# Altium project UltraZohm Analog SlowADC Signal Adapter 1v01 3U.PrjPcb (part 1 of 2)
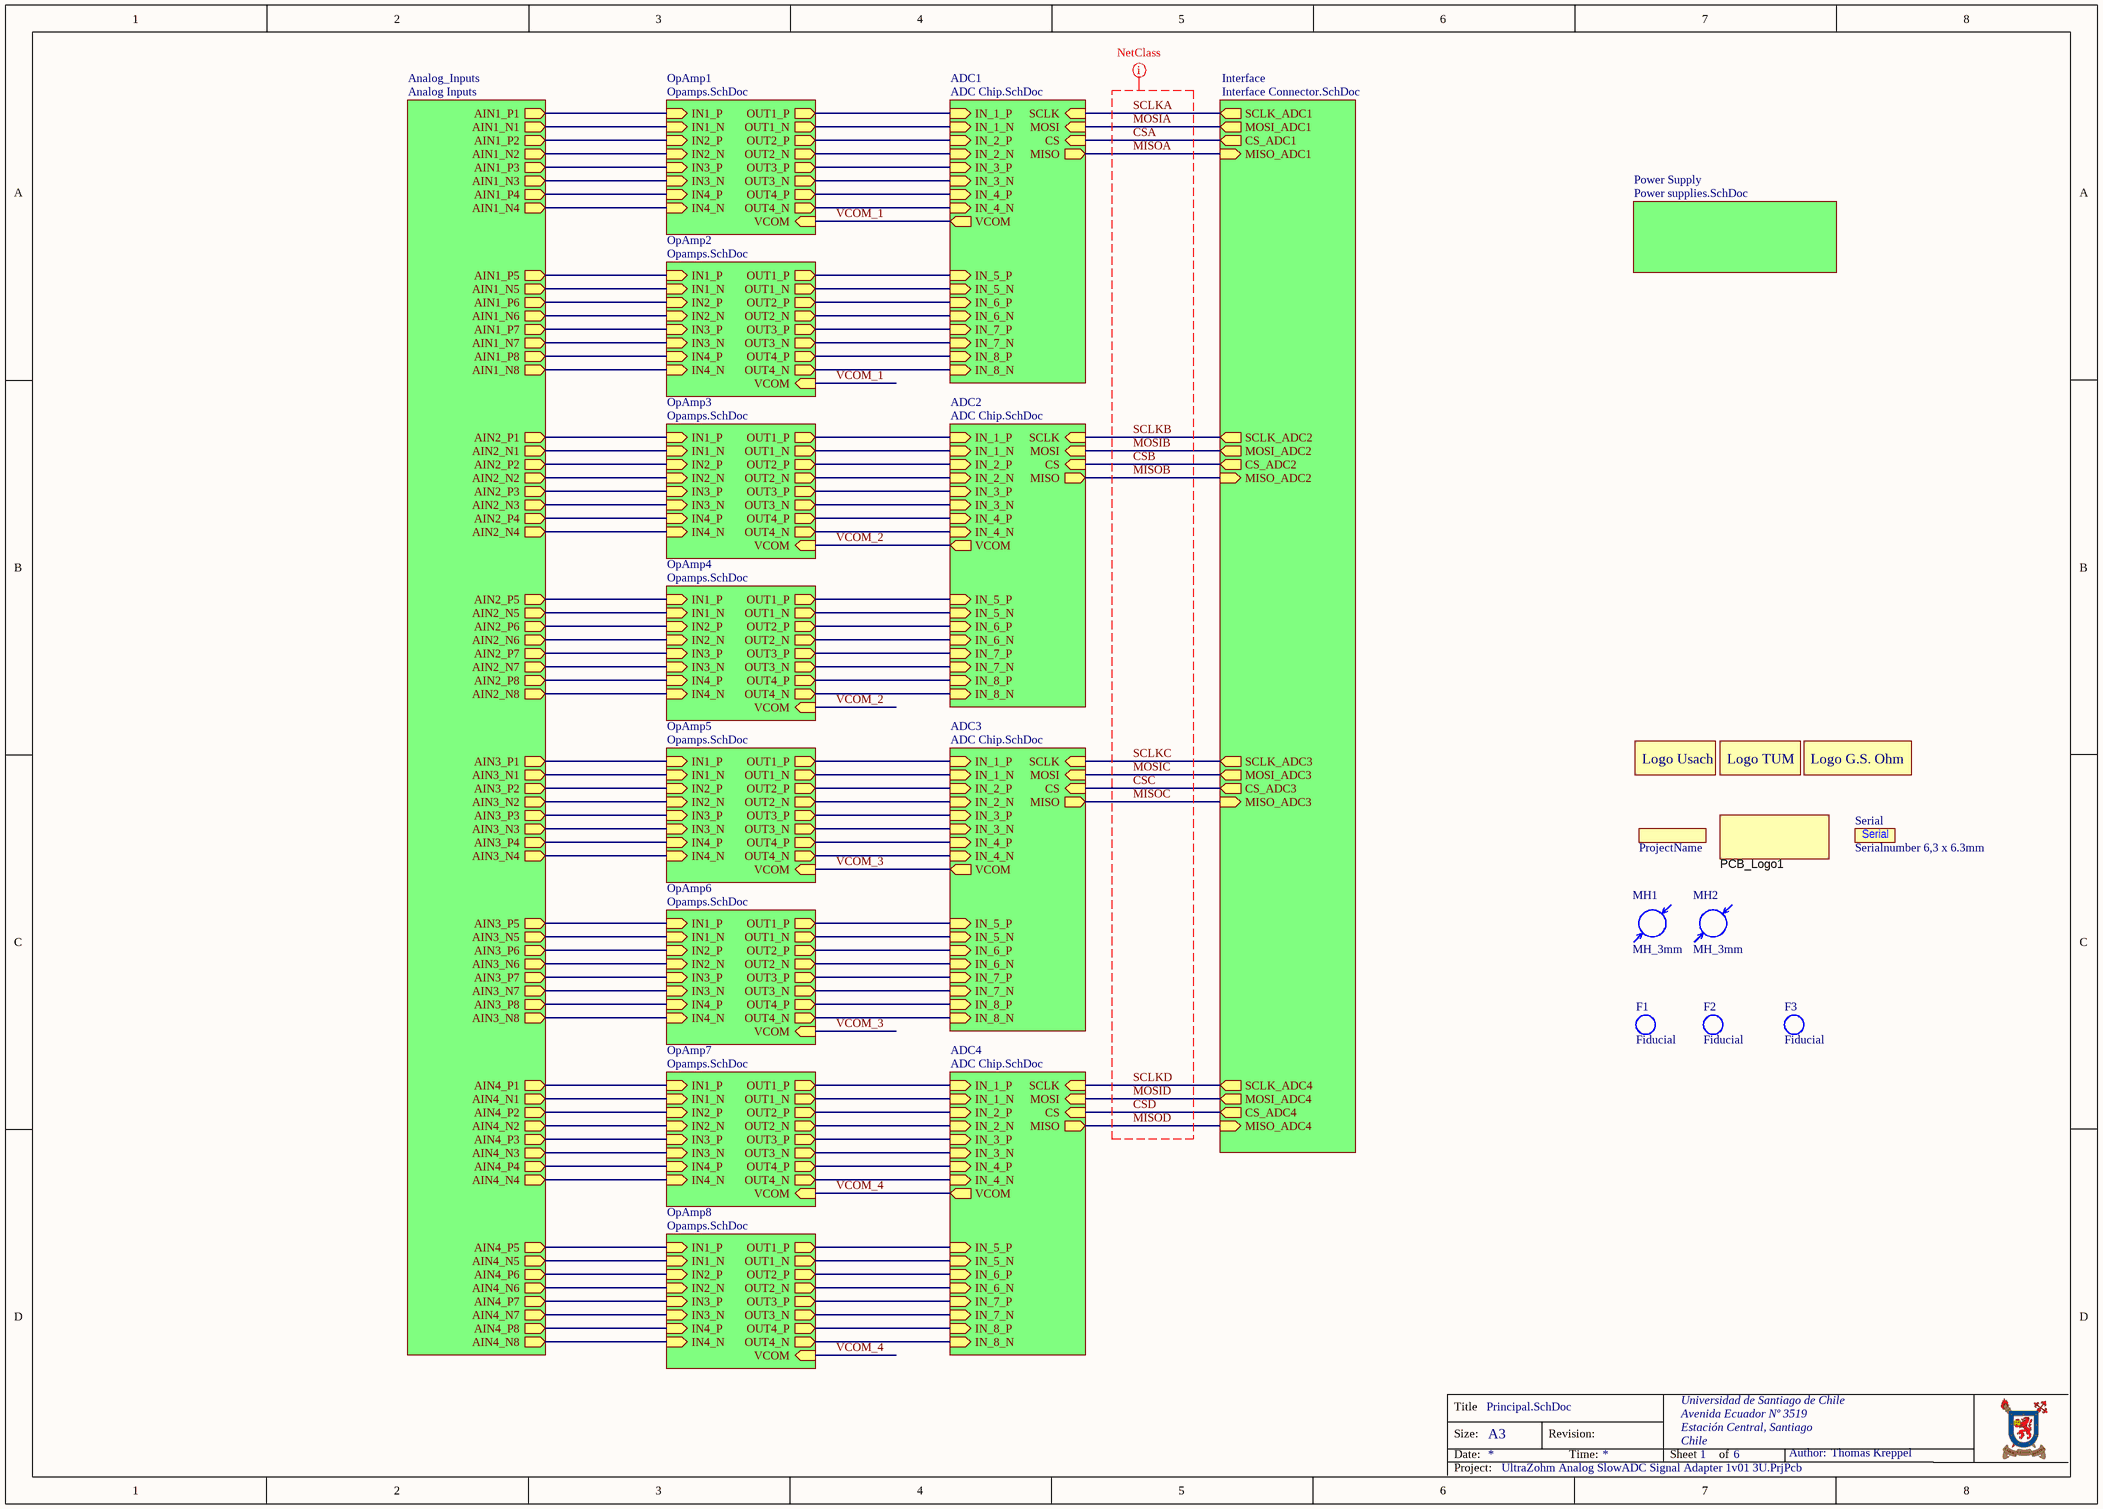
[diagram p0: Principal.SchDoc]
ProjectRevision: 1v01
5 sheets, 498 parts. Net scope: hierarchical (ports join the sheet entries above them; power ports are global).
Board file: UltraZohm_Analog_Slow_ADC Signal Adapter 1v01 3U.PcbDoc
Sheets:
  Principal.SchDoc
    Interface = Interface Connector.SchDoc
    Analog_Inputs = Analog Inputs.SchDoc
    Power Supply = Power supplies.SchDoc
    OpAmp1 = Opamps.SchDoc
    OpAmp2 = Opamps.SchDoc
    OpAmp3 = Opamps.SchDoc
    OpAmp4 = Opamps.SchDoc
    OpAmp5 = Opamps.SchDoc
    OpAmp6 = Opamps.SchDoc
    OpAmp7 = Opamps.SchDoc
    OpAmp8 = Opamps.SchDoc

## Sheet Principal.SchDoc
size A3; Author: Thomas Kreppel; CompanyName: Universidad de Santiago de Chile; Address1: Avenida Ecuador Nº 3519; Address2: Estación Central, Santiago; Address3: Chile; DocumentNumber: 1; Revision: 1v01; SheetNumber: 1; SheetTotal: 6

### Parts
F1  Fiducial  [Fiducial_1.7mm]  (no BOM)
F2  Fiducial  [Fiducial_1.7mm]  (no BOM)
F3  Fiducial  [Fiducial_1.7mm]  (no BOM)
Logo1  LOGO USACH  [Logo Usach]  (value not drawn)  (no BOM)
Logo2  LOGO TUM  [Logo TUM]  (value not drawn)  (no BOM)
Logo3  LOGO G.S. Ohm  [Logo G.S.Ohm University]  (value not drawn)  (no BOM)
MH1  MH_3mm  [Mounting Hole]  (no BOM)
MH2  MH_3mm  [Mounting Hole]  (no BOM)
PCB_Logo1  ESD Susceptible  [ESD_Overlay_Medium]  (value not drawn)  (no BOM)
ProjectName  Project Name, Rev  [ID_ProjectRev]  (value not drawn)  (no BOM)
Serial  Serialnumber 6,3 x 6.3mm  [Serial_6.3x6.3mm]  (no BOM)

### Sub-sheets
ADC1 = ADC Chip.SchDoc (file not in this document): IN_1_P (in), IN_7_N (in), IN_5_P (in), IN_4_P (in), IN_1_N (in), MOSI (in), IN_6_P (in), IN_2_P (in), IN_2_N (in), IN_5_N (in), CS (in), IN_6_N (in), IN_3_N (in), IN_8_N (in), IN_7_P (in), IN_4_N (in), MISO (out), IN_8_P (in), SCLK (in), IN_3_P (in), VCOM (out)
ADC2 = ADC Chip.SchDoc (file not in this document): IN_1_P (in), IN_7_N (in), IN_5_P (in), IN_4_P (in), IN_1_N (in), MOSI (in), IN_6_P (in), IN_2_P (in), IN_2_N (in), IN_5_N (in), CS (in), IN_6_N (in), IN_3_N (in), IN_8_N (in), IN_7_P (in), IN_4_N (in), MISO (out), IN_8_P (in), SCLK (in), IN_3_P (in), VCOM (out)
ADC3 = ADC Chip.SchDoc (file not in this document): IN_1_P (in), IN_7_N (in), IN_5_P (in), IN_4_P (in), IN_1_N (in), MOSI (in), IN_6_P (in), IN_2_P (in), IN_2_N (in), IN_5_N (in), CS (in), IN_6_N (in), IN_3_N (in), IN_8_N (in), IN_7_P (in), IN_4_N (in), MISO (out), IN_8_P (in), SCLK (in), IN_3_P (in), VCOM (out)
ADC4 = ADC Chip.SchDoc (file not in this document): IN_1_P (in), IN_7_N (in), IN_5_P (in), IN_4_P (in), IN_1_N (in), MOSI (in), IN_6_P (in), IN_2_P (in), IN_2_N (in), IN_5_N (in), CS (in), IN_6_N (in), IN_3_N (in), IN_8_N (in), IN_7_P (in), IN_4_N (in), MISO (out), IN_8_P (in), SCLK (in), IN_3_P (in), VCOM (out)
Analog_Inputs = Analog Inputs: AIN1_N1 (out), AIN1_P1 (out), AIN1_N8 (out), AIN1_N7 (out), AIN2_N1 (out), AIN2_P1 (out), AIN2_P6 (out), AIN1_P2 (out), AIN1_P3 (out), AIN2_P2 (out), AIN2_P4 (out), AIN2_P8 (out), AIN1_P7 (out), AIN1_P5 (out), AIN1_N3 (out), AIN1_N2 (out), AIN1_N5 (out), AIN2_P5 (out), AIN1_P6 (out), AIN1_N4 (out), AIN1_P8 (out), AIN2_P3 (out), AIN2_P7 (out), AIN1_P4 (out), AIN1_N6 (out), AIN4_P8 (out), AIN3_P2 (out), AIN3_P7 (out), AIN2_N7 (out), AIN4_N3 (out), AIN2_N3 (out), AIN3_P1 (out), AIN4_P5 (out), AIN3_P5 (out), AIN3_N7 (out), AIN4_N2 (out), AIN4_N1 (out), AIN3_P4 (out), AIN4_P7 (out), AIN4_P3 (out), AIN3_P6 (out), AIN3_N1 (out), AIN4_N7 (out), AIN3_P8 (out), AIN4_N8 (out), AIN3_N3 (out), AIN2_N5 (out), AIN2_N4 (out), AIN4_P4 (out), AIN3_N2 (out), AIN4_N5 (out), AIN2_N8 (out), AIN3_N6 (out), AIN4_P1 (out), AIN4_N4 (out), AIN3_N4 (out), AIN2_N6 (out), AIN4_P2 (out), AIN4_P6 (out), AIN3_N8 (out), AIN4_N6 (out), AIN2_N2 (out), AIN3_N5 (out), AIN3_P3 (out)
Interface = Interface Connector.SchDoc: CS_ADC2 (out), CS_ADC4 (out), SCLK_ADC2 (out), SCLK_ADC4 (out), CS_ADC1 (out), MISO_ADC1 (in), MOSI_ADC4 (out), CS_ADC3 (out), SCLK_ADC3 (out), MOSI_ADC2 (out), MOSI_ADC3 (out), MISO_ADC4 (in), MISO_ADC3 (in), MISO_ADC2 (in), SCLK_ADC1 (out), MOSI_ADC1 (out)
OpAmp1 = Opamps.SchDoc: IN2_P (in), IN1_N (in), OUT3_P (out), IN4_P (in), IN3_N (in), OUT3_N (out), IN4_N (in), OUT4_N (out), OUT4_P (out), IN2_N (in), OUT1_N (out), OUT2_N (out), OUT1_P (out), VCOM (in), IN3_P (in), OUT2_P (out), IN1_P (in)
OpAmp2 = Opamps.SchDoc: IN2_P (in), IN1_N (in), OUT3_P (out), IN4_P (in), IN3_N (in), OUT3_N (out), IN4_N (in), OUT4_N (out), OUT4_P (out), IN2_N (in), OUT1_N (out), OUT2_N (out), OUT1_P (out), VCOM (in), IN3_P (in), OUT2_P (out), IN1_P (in)
OpAmp3 = Opamps.SchDoc: IN2_P (in), IN1_N (in), OUT3_P (out), IN4_P (in), IN3_N (in), OUT3_N (out), IN4_N (in), OUT4_N (out), OUT4_P (out), IN2_N (in), OUT1_N (out), OUT2_N (out), OUT1_P (out), VCOM (in), IN3_P (in), OUT2_P (out), IN1_P (in)
OpAmp4 = Opamps.SchDoc: IN2_P (in), IN1_N (in), OUT3_P (out), IN4_P (in), IN3_N (in), OUT3_N (out), IN4_N (in), OUT4_N (out), OUT4_P (out), IN2_N (in), OUT1_N (out), OUT2_N (out), OUT1_P (out), VCOM (in), IN3_P (in), OUT2_P (out), IN1_P (in)
OpAmp5 = Opamps.SchDoc: IN2_P (in), IN1_N (in), OUT3_P (out), IN4_P (in), IN3_N (in), OUT3_N (out), IN4_N (in), OUT4_N (out), OUT4_P (out), IN2_N (in), OUT1_N (out), OUT2_N (out), OUT1_P (out), VCOM (in), IN3_P (in), OUT2_P (out), IN1_P (in)
OpAmp6 = Opamps.SchDoc: IN2_P (in), IN1_N (in), OUT3_P (out), IN4_P (in), IN3_N (in), OUT3_N (out), IN4_N (in), OUT4_N (out), OUT4_P (out), IN2_N (in), OUT1_N (out), OUT2_N (out), OUT1_P (out), VCOM (in), IN3_P (in), OUT2_P (out), IN1_P (in)
OpAmp7 = Opamps.SchDoc: IN2_P (in), IN1_N (in), OUT3_P (out), IN4_P (in), IN3_N (in), OUT3_N (out), IN4_N (in), OUT4_N (out), OUT4_P (out), IN2_N (in), OUT1_N (out), OUT2_N (out), OUT1_P (out), VCOM (in), IN3_P (in), OUT2_P (out), IN1_P (in)
OpAmp8 = Opamps.SchDoc: IN2_P (in), IN1_N (in), OUT3_P (out), IN4_P (in), IN3_N (in), OUT3_N (out), IN4_N (in), OUT4_N (out), OUT4_P (out), IN2_N (in), OUT1_N (out), OUT2_N (out), OUT1_P (out), VCOM (in), IN3_P (in), OUT2_P (out), IN1_P (in)
Power Supply = Power supplies.SchDoc: no entries

### Nets
ADC_IN1_N_OpAmp1: sheet ADC1/IN_1_N, sheet OpAmp1/OUT1_N
ADC_IN1_N_OpAmp2: sheet ADC1/IN_5_N, sheet OpAmp2/OUT1_N
ADC_IN1_N_OpAmp3: sheet ADC2/IN_1_N, sheet OpAmp3/OUT1_N
ADC_IN1_N_OpAmp4: sheet ADC2/IN_5_N, sheet OpAmp4/OUT1_N
ADC_IN1_N_OpAmp5: sheet ADC3/IN_1_N, sheet OpAmp5/OUT1_N
ADC_IN1_N_OpAmp6: sheet ADC3/IN_5_N, sheet OpAmp6/OUT1_N
ADC_IN1_N_OpAmp7: sheet ADC4/IN_1_N, sheet OpAmp7/OUT1_N
ADC_IN1_N_OpAmp8: sheet ADC4/IN_5_N, sheet OpAmp8/OUT1_N
ADC_IN1_P_OpAmp1: sheet ADC1/IN_1_P, sheet OpAmp1/OUT1_P
ADC_IN1_P_OpAmp2: sheet ADC1/IN_5_P, sheet OpAmp2/OUT1_P
ADC_IN1_P_OpAmp3: sheet ADC2/IN_1_P, sheet OpAmp3/OUT1_P
ADC_IN1_P_OpAmp4: sheet ADC2/IN_5_P, sheet OpAmp4/OUT1_P
ADC_IN1_P_OpAmp5: sheet ADC3/IN_1_P, sheet OpAmp5/OUT1_P
ADC_IN1_P_OpAmp6: sheet ADC3/IN_5_P, sheet OpAmp6/OUT1_P
ADC_IN1_P_OpAmp7: sheet ADC4/IN_1_P, sheet OpAmp7/OUT1_P
ADC_IN1_P_OpAmp8: sheet ADC4/IN_5_P, sheet OpAmp8/OUT1_P
ADC_IN2_N_OpAmp1: sheet ADC1/IN_2_N, sheet OpAmp1/OUT2_N
ADC_IN2_N_OpAmp2: sheet ADC1/IN_6_N, sheet OpAmp2/OUT2_N
ADC_IN2_N_OpAmp3: sheet ADC2/IN_2_N, sheet OpAmp3/OUT2_N
ADC_IN2_N_OpAmp4: sheet ADC2/IN_6_N, sheet OpAmp4/OUT2_N
ADC_IN2_N_OpAmp5: sheet ADC3/IN_2_N, sheet OpAmp5/OUT2_N
ADC_IN2_N_OpAmp6: sheet ADC3/IN_6_N, sheet OpAmp6/OUT2_N
ADC_IN2_N_OpAmp7: sheet ADC4/IN_2_N, sheet OpAmp7/OUT2_N
ADC_IN2_N_OpAmp8: sheet ADC4/IN_6_N, sheet OpAmp8/OUT2_N
ADC_IN2_P_OpAmp1: sheet ADC1/IN_2_P, sheet OpAmp1/OUT2_P
ADC_IN2_P_OpAmp2: sheet ADC1/IN_6_P, sheet OpAmp2/OUT2_P
ADC_IN2_P_OpAmp3: sheet ADC2/IN_2_P, sheet OpAmp3/OUT2_P
ADC_IN2_P_OpAmp4: sheet ADC2/IN_6_P, sheet OpAmp4/OUT2_P
ADC_IN2_P_OpAmp5: sheet ADC3/IN_2_P, sheet OpAmp5/OUT2_P
ADC_IN2_P_OpAmp6: sheet ADC3/IN_6_P, sheet OpAmp6/OUT2_P
ADC_IN2_P_OpAmp7: sheet ADC4/IN_2_P, sheet OpAmp7/OUT2_P
ADC_IN2_P_OpAmp8: sheet ADC4/IN_6_P, sheet OpAmp8/OUT2_P
ADC_IN3_N_OpAmp1: sheet ADC1/IN_3_N, sheet OpAmp1/OUT3_N
ADC_IN3_N_OpAmp2: sheet ADC1/IN_7_N, sheet OpAmp2/OUT3_N
ADC_IN3_N_OpAmp3: sheet ADC2/IN_3_N, sheet OpAmp3/OUT3_N
ADC_IN3_N_OpAmp4: sheet ADC2/IN_7_N, sheet OpAmp4/OUT3_N
ADC_IN3_N_OpAmp5: sheet ADC3/IN_3_N, sheet OpAmp5/OUT3_N
ADC_IN3_N_OpAmp6: sheet ADC3/IN_7_N, sheet OpAmp6/OUT3_N
ADC_IN3_N_OpAmp7: sheet ADC4/IN_3_N, sheet OpAmp7/OUT3_N
ADC_IN3_N_OpAmp8: sheet ADC4/IN_7_N, sheet OpAmp8/OUT3_N
ADC_IN3_P_OpAmp1: sheet ADC1/IN_3_P, sheet OpAmp1/OUT3_P
ADC_IN3_P_OpAmp2: sheet ADC1/IN_7_P, sheet OpAmp2/OUT3_P
ADC_IN3_P_OpAmp3: sheet ADC2/IN_3_P, sheet OpAmp3/OUT3_P
ADC_IN3_P_OpAmp4: sheet ADC2/IN_7_P, sheet OpAmp4/OUT3_P
ADC_IN3_P_OpAmp5: sheet ADC3/IN_3_P, sheet OpAmp5/OUT3_P
ADC_IN3_P_OpAmp6: sheet ADC3/IN_7_P, sheet OpAmp6/OUT3_P
ADC_IN3_P_OpAmp7: sheet ADC4/IN_3_P, sheet OpAmp7/OUT3_P
ADC_IN3_P_OpAmp8: sheet ADC4/IN_7_P, sheet OpAmp8/OUT3_P
ADC_IN4_N_OpAmp1: sheet ADC1/IN_4_N, sheet OpAmp1/OUT4_N
ADC_IN4_N_OpAmp2: sheet ADC1/IN_8_N, sheet OpAmp2/OUT4_N
ADC_IN4_N_OpAmp3: sheet ADC2/IN_4_N, sheet OpAmp3/OUT4_N
ADC_IN4_N_OpAmp4: sheet ADC2/IN_8_N, sheet OpAmp4/OUT4_N
ADC_IN4_N_OpAmp5: sheet ADC3/IN_4_N, sheet OpAmp5/OUT4_N
ADC_IN4_N_OpAmp6: sheet ADC3/IN_8_N, sheet OpAmp6/OUT4_N
ADC_IN4_N_OpAmp7: sheet ADC4/IN_4_N, sheet OpAmp7/OUT4_N
ADC_IN4_N_OpAmp8: sheet ADC4/IN_8_N, sheet OpAmp8/OUT4_N
ADC_IN4_P_OpAmp1: sheet ADC1/IN_4_P, sheet OpAmp1/OUT4_P
ADC_IN4_P_OpAmp2: sheet ADC1/IN_8_P, sheet OpAmp2/OUT4_P
ADC_IN4_P_OpAmp3: sheet ADC2/IN_4_P, sheet OpAmp3/OUT4_P
ADC_IN4_P_OpAmp4: sheet ADC2/IN_8_P, sheet OpAmp4/OUT4_P
ADC_IN4_P_OpAmp5: sheet ADC3/IN_4_P, sheet OpAmp5/OUT4_P
ADC_IN4_P_OpAmp6: sheet ADC3/IN_8_P, sheet OpAmp6/OUT4_P
ADC_IN4_P_OpAmp7: sheet ADC4/IN_4_P, sheet OpAmp7/OUT4_P
ADC_IN4_P_OpAmp8: sheet ADC4/IN_8_P, sheet OpAmp8/OUT4_P
AIN1_N: sheet Analog_Inputs/AIN4_N1, sheet OpAmp7/IN1_N
AIN1_N: sheet Analog_Inputs/AIN3_N1, sheet OpAmp5/IN1_N  [a separate net that carries the same name]
AIN1_N: sheet Analog_Inputs/AIN2_N1, sheet OpAmp3/IN1_N  [a separate net that carries the same name]
AIN1_N: sheet Analog_Inputs/AIN1_N1, sheet OpAmp1/IN1_N  [a separate net that carries the same name]
AIN1_N: sheet Analog_Inputs/AIN1_N5, sheet OpAmp2/IN1_N  [a separate net that carries the same name]
AIN1_N: sheet Analog_Inputs/AIN2_N5, sheet OpAmp4/IN1_N  [a separate net that carries the same name]
AIN1_N: sheet Analog_Inputs/AIN3_N5, sheet OpAmp6/IN1_N  [a separate net that carries the same name]
AIN1_N: sheet Analog_Inputs/AIN4_N5, sheet OpAmp8/IN1_N  [a separate net that carries the same name]
AIN1_P: sheet Analog_Inputs/AIN4_P1, sheet OpAmp7/IN1_P
AIN1_P: sheet Analog_Inputs/AIN3_P1, sheet OpAmp5/IN1_P  [a separate net that carries the same name]
AIN1_P: sheet Analog_Inputs/AIN2_P1, sheet OpAmp3/IN1_P  [a separate net that carries the same name]
AIN1_P: sheet Analog_Inputs/AIN1_P1, sheet OpAmp1/IN1_P  [a separate net that carries the same name]
AIN1_P: sheet Analog_Inputs/AIN1_P5, sheet OpAmp2/IN1_P  [a separate net that carries the same name]
AIN1_P: sheet Analog_Inputs/AIN2_P5, sheet OpAmp4/IN1_P  [a separate net that carries the same name]
AIN1_P: sheet Analog_Inputs/AIN3_P5, sheet OpAmp6/IN1_P  [a separate net that carries the same name]
AIN1_P: sheet Analog_Inputs/AIN4_P5, sheet OpAmp8/IN1_P  [a separate net that carries the same name]
AIN2_N: sheet Analog_Inputs/AIN4_N2, sheet OpAmp7/IN2_N
AIN2_N: sheet Analog_Inputs/AIN3_N2, sheet OpAmp5/IN2_N  [a separate net that carries the same name]
AIN2_N: sheet Analog_Inputs/AIN2_N2, sheet OpAmp3/IN2_N  [a separate net that carries the same name]
AIN2_N: sheet Analog_Inputs/AIN1_N2, sheet OpAmp1/IN2_N  [a separate net that carries the same name]
AIN2_N: sheet Analog_Inputs/AIN1_N6, sheet OpAmp2/IN2_N  [a separate net that carries the same name]
AIN2_N: sheet Analog_Inputs/AIN2_N6, sheet OpAmp4/IN2_N  [a separate net that carries the same name]
AIN2_N: sheet Analog_Inputs/AIN3_N6, sheet OpAmp6/IN2_N  [a separate net that carries the same name]
AIN2_N: sheet Analog_Inputs/AIN4_N6, sheet OpAmp8/IN2_N  [a separate net that carries the same name]
AIN2_P: sheet Analog_Inputs/AIN4_P2, sheet OpAmp7/IN2_P
AIN2_P: sheet Analog_Inputs/AIN3_P2, sheet OpAmp5/IN2_P  [a separate net that carries the same name]
AIN2_P: sheet Analog_Inputs/AIN2_P2, sheet OpAmp3/IN2_P  [a separate net that carries the same name]
AIN2_P: sheet Analog_Inputs/AIN1_P2, sheet OpAmp1/IN2_P  [a separate net that carries the same name]
AIN2_P: sheet Analog_Inputs/AIN1_P6, sheet OpAmp2/IN2_P  [a separate net that carries the same name]
AIN2_P: sheet Analog_Inputs/AIN2_P6, sheet OpAmp4/IN2_P  [a separate net that carries the same name]
AIN2_P: sheet Analog_Inputs/AIN3_P6, sheet OpAmp6/IN2_P  [a separate net that carries the same name]
AIN2_P: sheet Analog_Inputs/AIN4_P6, sheet OpAmp8/IN2_P  [a separate net that carries the same name]
AIN3_N: sheet Analog_Inputs/AIN4_N3, sheet OpAmp7/IN3_N
AIN3_N: sheet Analog_Inputs/AIN3_N3, sheet OpAmp5/IN3_N  [a separate net that carries the same name]
AIN3_N: sheet Analog_Inputs/AIN2_N3, sheet OpAmp3/IN3_N  [a separate net that carries the same name]
AIN3_N: sheet Analog_Inputs/AIN1_N3, sheet OpAmp1/IN3_N  [a separate net that carries the same name]
AIN3_N: sheet Analog_Inputs/AIN1_N7, sheet OpAmp2/IN3_N  [a separate net that carries the same name]
AIN3_N: sheet Analog_Inputs/AIN2_N7, sheet OpAmp4/IN3_N  [a separate net that carries the same name]
AIN3_N: sheet Analog_Inputs/AIN3_N7, sheet OpAmp6/IN3_N  [a separate net that carries the same name]
AIN3_N: sheet Analog_Inputs/AIN4_N7, sheet OpAmp8/IN3_N  [a separate net that carries the same name]
AIN3_P: sheet Analog_Inputs/AIN4_P3, sheet OpAmp7/IN3_P
AIN3_P: sheet Analog_Inputs/AIN3_P3, sheet OpAmp5/IN3_P  [a separate net that carries the same name]
AIN3_P: sheet Analog_Inputs/AIN2_P3, sheet OpAmp3/IN3_P  [a separate net that carries the same name]
AIN3_P: sheet Analog_Inputs/AIN1_P3, sheet OpAmp1/IN3_P  [a separate net that carries the same name]
AIN3_P: sheet Analog_Inputs/AIN1_P7, sheet OpAmp2/IN3_P  [a separate net that carries the same name]
AIN3_P: sheet Analog_Inputs/AIN2_P7, sheet OpAmp4/IN3_P  [a separate net that carries the same name]
AIN3_P: sheet Analog_Inputs/AIN3_P7, sheet OpAmp6/IN3_P  [a separate net that carries the same name]
AIN3_P: sheet Analog_Inputs/AIN4_P7, sheet OpAmp8/IN3_P  [a separate net that carries the same name]
AIN4_N: sheet Analog_Inputs/AIN4_N4, sheet OpAmp7/IN4_N
AIN4_N: sheet Analog_Inputs/AIN3_N4, sheet OpAmp5/IN4_N  [a separate net that carries the same name]
AIN4_N: sheet Analog_Inputs/AIN2_N4, sheet OpAmp3/IN4_N  [a separate net that carries the same name]
AIN4_N: sheet Analog_Inputs/AIN1_N4, sheet OpAmp1/IN4_N  [a separate net that carries the same name]
AIN4_N: sheet Analog_Inputs/AIN1_N8, sheet OpAmp2/IN4_N  [a separate net that carries the same name]
AIN4_N: sheet Analog_Inputs/AIN2_N8, sheet OpAmp4/IN4_N  [a separate net that carries the same name]
AIN4_N: sheet Analog_Inputs/AIN3_N8, sheet OpAmp6/IN4_N  [a separate net that carries the same name]
AIN4_N: sheet Analog_Inputs/AIN4_N8, sheet OpAmp8/IN4_N  [a separate net that carries the same name]
AIN4_P: sheet Analog_Inputs/AIN4_P4, sheet OpAmp7/IN4_P
AIN4_P: sheet Analog_Inputs/AIN3_P4, sheet OpAmp5/IN4_P  [a separate net that carries the same name]
AIN4_P: sheet Analog_Inputs/AIN2_P4, sheet OpAmp3/IN4_P  [a separate net that carries the same name]
AIN4_P: sheet Analog_Inputs/AIN1_P4, sheet OpAmp1/IN4_P  [a separate net that carries the same name]
AIN4_P: sheet Analog_Inputs/AIN1_P8, sheet OpAmp2/IN4_P  [a separate net that carries the same name]
AIN4_P: sheet Analog_Inputs/AIN2_P8, sheet OpAmp4/IN4_P  [a separate net that carries the same name]
AIN4_P: sheet Analog_Inputs/AIN3_P8, sheet OpAmp6/IN4_P  [a separate net that carries the same name]
AIN4_P: sheet Analog_Inputs/AIN4_P8, sheet OpAmp8/IN4_P  [a separate net that carries the same name]
CSA: sheet Interface/CS_ADC1, sheet ADC1/CS
CSB: sheet Interface/CS_ADC2, sheet ADC2/CS
CSC: sheet Interface/CS_ADC3, sheet ADC3/CS
CSD: sheet Interface/CS_ADC4, sheet ADC4/CS
MISOA: sheet Interface/MISO_ADC1, sheet ADC1/MISO
MISOB: sheet Interface/MISO_ADC2, sheet ADC2/MISO
MISOC: sheet Interface/MISO_ADC3, sheet ADC3/MISO
MISOD: sheet Interface/MISO_ADC4, sheet ADC4/MISO
MOSIA: sheet Interface/MOSI_ADC1, sheet ADC1/MOSI
MOSIB: sheet Interface/MOSI_ADC2, sheet ADC2/MOSI
MOSIC: sheet Interface/MOSI_ADC3, sheet ADC3/MOSI
MOSID: sheet Interface/MOSI_ADC4, sheet ADC4/MOSI
SCLKA: sheet Interface/SCLK_ADC1, sheet ADC1/SCLK
SCLKB: sheet Interface/SCLK_ADC2, sheet ADC2/SCLK
SCLKC: sheet Interface/SCLK_ADC3, sheet ADC3/SCLK
SCLKD: sheet Interface/SCLK_ADC4, sheet ADC4/SCLK
VCOM_1: sheet ADC1/VCOM, sheet OpAmp1/VCOM, sheet OpAmp2/VCOM  [project net VCOM]
VCOM_2: sheet ADC2/VCOM, sheet OpAmp3/VCOM, sheet OpAmp4/VCOM  [project net VCOM]
VCOM_3: sheet ADC3/VCOM, sheet OpAmp5/VCOM, sheet OpAmp6/VCOM  [project net VCOM]
VCOM_4: sheet ADC4/VCOM, sheet OpAmp7/VCOM, sheet OpAmp8/VCOM  [project net VCOM]

### Layout directives
net class Match_single: CSA, CSB, CSC, CSD, MISOA, MISOB, MISOC, MISOD, MOSIA, MOSIB, MOSIC, MOSID, SCLKA, SCLKB, SCLKC, SCLKD

### Notes on the sheet
- Title
- Size:
- Date:
- A3
- Revision:
- Time:
- Sheet
- of
- Author:
- Project:
- (in symbol LOGO G.S. Ohm) Logo G.S. Ohm
- (in symbol LOGO TUM) Logo TUM
- (in symbol LOGO USACH) Logo Usach

### Library data of the parts
F1-F3 = Fiducial: Fiducial for Assembler
PCB_Logo1 = LOGO_ESD_Susceptible: ESD Susceptible Symbol; Created: 2018_11_25_AGeiger; Value: ESD Susceptible
ProjectName = ID_ProjectRev: Project Name and Revision Number; Created: 2018_11_23_AGeiger; Value: Project Name, Rev
Serial = SerialNumber: Created: 2018_09_18_AGeiger; Value: Serialnumber 6,3 x 6.3mm

## Sheet Interface Connector.SchDoc
size A4; Author: Thomas Kreppel; CompanyName: Universidad de Santiago de Chile; Address1: Avenida Ecuador Nº 3519; Address2: Estación Central, Santiago; Address3: Chile; DocumentNumber: 2; Revision: 1v01; SheetNumber: 2; SheetTotal: 6
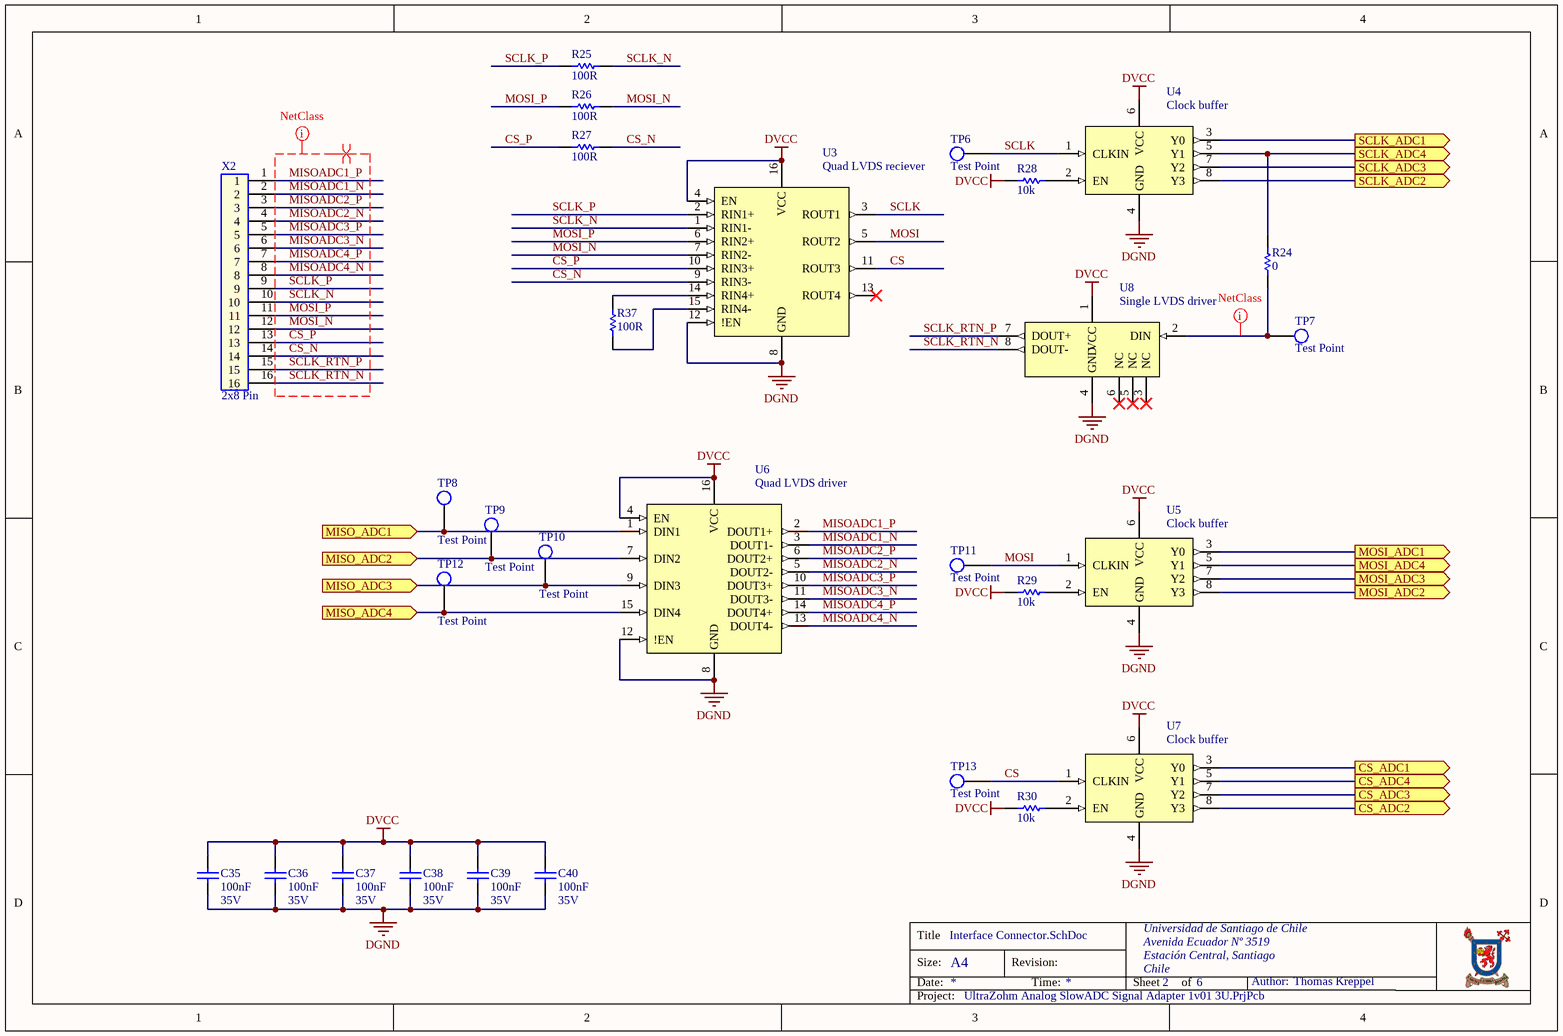
[diagram p1: Interface Connector.SchDoc]

### Parts
C35  100nF  Voltage: 35V  [CAP_0603]
C36  100nF  Voltage: 35V  [CAP_0603]
C37  100nF  Voltage: 35V  [CAP_0603]
C38  100nF  Voltage: 35V  [CAP_0603]
C39  100nF  Voltage: 35V  [CAP_0603]
C40  100nF  Voltage: 35V  [CAP_0603]
R24  0  [RES_0603]
R25  100R  [RES_0603]
R26  100R  [RES_0603]
R27  100R  [RES_0603]
R28  10k  [RES_0603]
R29  10k  [RES_0603]
R30  10k  [RES_0603]
R37  100R  [RES_0603]
TP6  Test Point  [TP_1.6mm]  (no BOM)
TP7  Test Point  [TP_1.6mm]  (no BOM)
TP8  Test Point  [TP_1.6mm]  (no BOM)
TP9  Test Point  [TP_1.6mm]  (no BOM)
TP10  Test Point  [TP_1.6mm]  (no BOM)
TP11  Test Point  [TP_1.6mm]  (no BOM)
TP12  Test Point  [TP_1.6mm]  (no BOM)
TP13  Test Point  [TP_1.6mm]  (no BOM)
U3  Quad LVDS reciever  [TSOP65P640X120-16N]
U4  Clock buffer  [TSOP65P640X120-8N]
U5  Clock buffer  [TSOP65P640X120-8N]
U6  Quad LVDS driver  [TSOP65P640X120-16N]
U7  Clock buffer  [TSOP65P640X120-8N]
U8  Single LVDS driver  [SOIC127P600X170_HS-9N_no_THP]
X2  2x8 Pin  [EHF-108-01-F-D]

### Ports
CS_ADC1 (out), CS_ADC2 (out), CS_ADC3 (out), CS_ADC4 (out), MISO_ADC1 (in), MISO_ADC2 (in), MISO_ADC3 (in), MISO_ADC4 (in), MOSI_ADC1 (out), MOSI_ADC2 (out), MOSI_ADC3 (out), MOSI_ADC4 (out), SCLK_ADC1 (out), SCLK_ADC2 (out), SCLK_ADC3 (out), SCLK_ADC4 (out)

### Nets
DGND: C35.2 C36.2 C37.2 C38.2 C39.2 C40.2 U3.8(GND) U3.12(!EN) U4.4(GND) U5.4(GND) U6.8(GND) U6.12(!EN) U7.4(GND) U8.4(GND)
DVCC: C35.1 C36.1 C37.1 C38.1 C39.1 C40.1 R28.2 R29.2 R30.2 U3.4(EN) U3.16(VCC) U4.6(VCC) U5.6(VCC) U6.4(EN) U6.16(VCC) U7.6(VCC) U8.1(VCC)
CS: TP13.1 U3.11(ROUT3) U7.1(CLKIN)
CS_N: R27.1 U3.9(RIN3-) X2.14
CS_P: R27.2 U3.10(RIN3+) X2.13
CSA: U7.3(Y0) ; port CS_ADC1
CSB: U7.8(Y3) ; port CS_ADC2
CSC: U7.7(Y2) ; port CS_ADC3
CSD: U7.5(Y1) ; port CS_ADC4
MISOA: TP8.1 U6.1(DIN1) ; port MISO_ADC1
MISOADC1_N: U6.3(DOUT1-) X2.2
MISOADC1_P: U6.2(DOUT1+) X2.1
MISOADC2_N: U6.5(DOUT2-) X2.4
MISOADC2_P: U6.6(DOUT2+) X2.3
MISOADC3_N: U6.11(DOUT3-) X2.6
MISOADC3_P: U6.10(DOUT3+) X2.5
MISOADC4_N: U6.13(DOUT4-) X2.8
MISOADC4_P: U6.14(DOUT4+) X2.7
MISOB: TP9.1 U6.7(DIN2) ; port MISO_ADC2
MISOC: TP10.1 U6.9(DIN3) ; port MISO_ADC3
MISOD: TP12.1 U6.15(DIN4) ; port MISO_ADC4
MOSI: TP11.1 U3.5(ROUT2) U5.1(CLKIN)
MOSI_N: R26.1 U3.7(RIN2-) X2.12
MOSI_P: R26.2 U3.6(RIN2+) X2.11
MOSIA: U5.3(Y0) ; port MOSI_ADC1
MOSIB: U5.8(Y3) ; port MOSI_ADC2
MOSIC: U5.7(Y2) ; port MOSI_ADC3
MOSID: U5.5(Y1) ; port MOSI_ADC4
SCLK: TP6.1 U3.3(ROUT1) U4.1(CLKIN)
SCLK_N: R25.1 U3.1(RIN1-) X2.10
SCLK_P: R25.2 U3.2(RIN1+) X2.9
SCLK_RTN_N: U8.8(DOUT-) X2.16
SCLK_RTN_P: U8.7(DOUT+) X2.15
SCLKA: U4.3(Y0) ; port SCLK_ADC1
SCLKB: U4.8(Y3) ; port SCLK_ADC2
SCLKC: U4.7(Y2) ; port SCLK_ADC3
SCLKD: R24.1 U4.5(Y1) ; port SCLK_ADC4
NetR24_2: R24.2 TP7.1 U8.2(DIN)
NetR28_1: R28.1 U4.2(EN)
NetR29_1: R29.1 U5.2(EN)
NetR30_1: R30.1 U7.2(EN)
NetR37_1: R37.1 U3.15(RIN4-)
NetR37_2: R37.2 U3.14(RIN4+)

Not connected (* = marked no-connect by the designer): U3 13(ROUT4)*; U8 3(NC)* 5(NC)* 6(NC)*

### Layout directives
differential pair: CS_N, CS_P, MISOADC1_N, MISOADC1_P, MISOADC2_N, MISOADC2_P, MISOADC3_N, MISOADC3_P, MISOADC4_N, MISOADC4_P, MOSI_N, MOSI_P, SCLK_N, SCLK_P, SCLK_RTN_N, SCLK_RTN_P
net class Match_diff: CS_N, CS_P, MISOADC1_N, MISOADC1_P, MISOADC2_N, MISOADC2_P, MISOADC3_N, MISOADC3_P, MISOADC4_N, MISOADC4_P, MOSI_N, MOSI_P, SCLK_N, SCLK_P, SCLK_RTN_N, SCLK_RTN_P
net class Match_single: NetR24_2

### Notes on the sheet
- Title
- Size:
- Date:
- A4
- Revision:
- Time:
- Sheet
- of
- Author:
- Project:

### Library data of the parts
C35-C40 = Cap_0603: Capacitor; MPN: C0603C104M5RACTU; Rule: PcbType=ProtelPcb; MF: KEMET; Dielectricum: X7R; Tolerance: 10%; Published: 8-Jun-2000; LatestRevisionDate: 17-Jul-2002; LatestRevisionNote: Re-released for DXP Platform.; PackageReference: RAD-0.3; Publisher: Altium Limited; Value: 100nF; Supplier Part Number 1: 399-7845-1-ND; Supplier 1: Digikey; Package: 0603; LCSC Part Number: C14663
R24 = Res0603: Tolerance: 1%; Published: 8-Jun-2000; LatestRevisionDate: 17-Jul-2002; LatestRevisionNote: Re-released for DXP Platform.; PackageReference: AXIAL-0.3; Publisher: Altium Limited; PackageDescription: Axial Device, Thru-Hole; 2 Leads; 0.3 in Pin Spacing; Supplier Part Number 1: 311-0.0GRCT-ND; Value: 0; Supplier 1: Digikey; Package: 0603
R25-R27 R37 = Res0603: MPN: RC0603FR-07100RL; MF: Yageo; Tolerance: 1%; Published: 8-Jun-2000; LatestRevisionDate: 17-Jul-2002; LatestRevisionNote: Re-released for DXP Platform.; PackageReference: AXIAL-0.3; Publisher: Altium Limited; PackageDescription: Axial Device, Thru-Hole; 2 Leads; 0.3 in Pin Spacing; Supplier Part Number 1: 311-100HRCT-ND; Value: 100R; Supplier 1: Digikey; Package: 0603; LCSC Part Number: C22775
R28-R30 = Res0603: MPN: RC0603FR-0710KL; MF: Yageo; Tolerance: 1%; Published: 8-Jun-2000; LatestRevisionDate: 17-Jul-2002; LatestRevisionNote: Re-released for DXP Platform.; PackageReference: AXIAL-0.3; Publisher: Altium Limited; PackageDescription: Axial Device, Thru-Hole; 2 Leads; 0.3 in Pin Spacing; Value: 10k; Supplier Part Number 1: 311-10.0KHRCT-ND; Supplier 1: Digikey; Package: 0603
  R29 R30: Digikey Part-Number: 311-10.0KHRCT-ND
TP6-TP13 = TP: 1.6mm Test Point Keystone; MPN: 5006; MF: Keystone Electronics; Created: 2020_04_Kreppel; Supplier 1: Digikey; Supplier Part Number 1: 36-5006-ND
U3 = ADN4666: 3V, LVDS, quad, CMOS Differential Line Receiver; MPN: ADN4666ARUZ; MF: Analog Devices; Created: 2020_05_Kreppel; Supplier 1: Digikey; Supplier Part Number 1: ADN4666ARUZ-ND; LCSC Part Number: C658631
U4 U5 U7 = CDCV304: 1:4 200MHz LVCMOS clock buffer, general-purpose, PCI-X Compliant; MPN: CDCV304PWRG4; MF: Texas Instruments; Created: 2020_05_Kreppel; Supplier 1: Digikey; Supplier Part Number 1: 296-35899-1-ND; LCSC Part Number: C2649343
U6 = ADN4665: 3V, LVDS, Quad, CMOS Differential Line Driver; MPN: ADN4665ARUZ; MF: Analog Devices; Created: 2020_05_Kreppel; Supplier 1: Digikey; Supplier Part Number 1: ADN4665ARUZ-ND; LCSC Part Number: C658627
U8 = ADN4661: Single, 3V, CMOS, LVDS High Speed differential driver; MPN: ADN4661BRZ; MF: Analog Devices; Created: 2020_05_Kreppel; Supplier 1: Digikey; Supplier Part Number 1: ADN4661BRZ-ND; LCSC Part Number: C658621
X2 = EHF-108-01-F-D: Dual Row, 2x8 Shrouded IDC Header with Ejectors 50 mil pitch; MF: Samtec; Created: 2020_05_Kreppel; MPN: EHF-108-01-F-D; Supplier 1: Digikey; Supplier Part Number 1: SAM9265-ND; LCSC Part Number: C17569033

## Sheet Analog Inputs.SchDoc
size A4; Author: Thomas Kreppel; CompanyName: Universidad de Santiago de Chile; Address1: Avenida Ecuador Nº 3519; Address2: Estación Central, Santiago; Address3: Chile; DocumentNumber: 5; Revision: 1v01; SheetNumber: 5; SheetTotal: 6
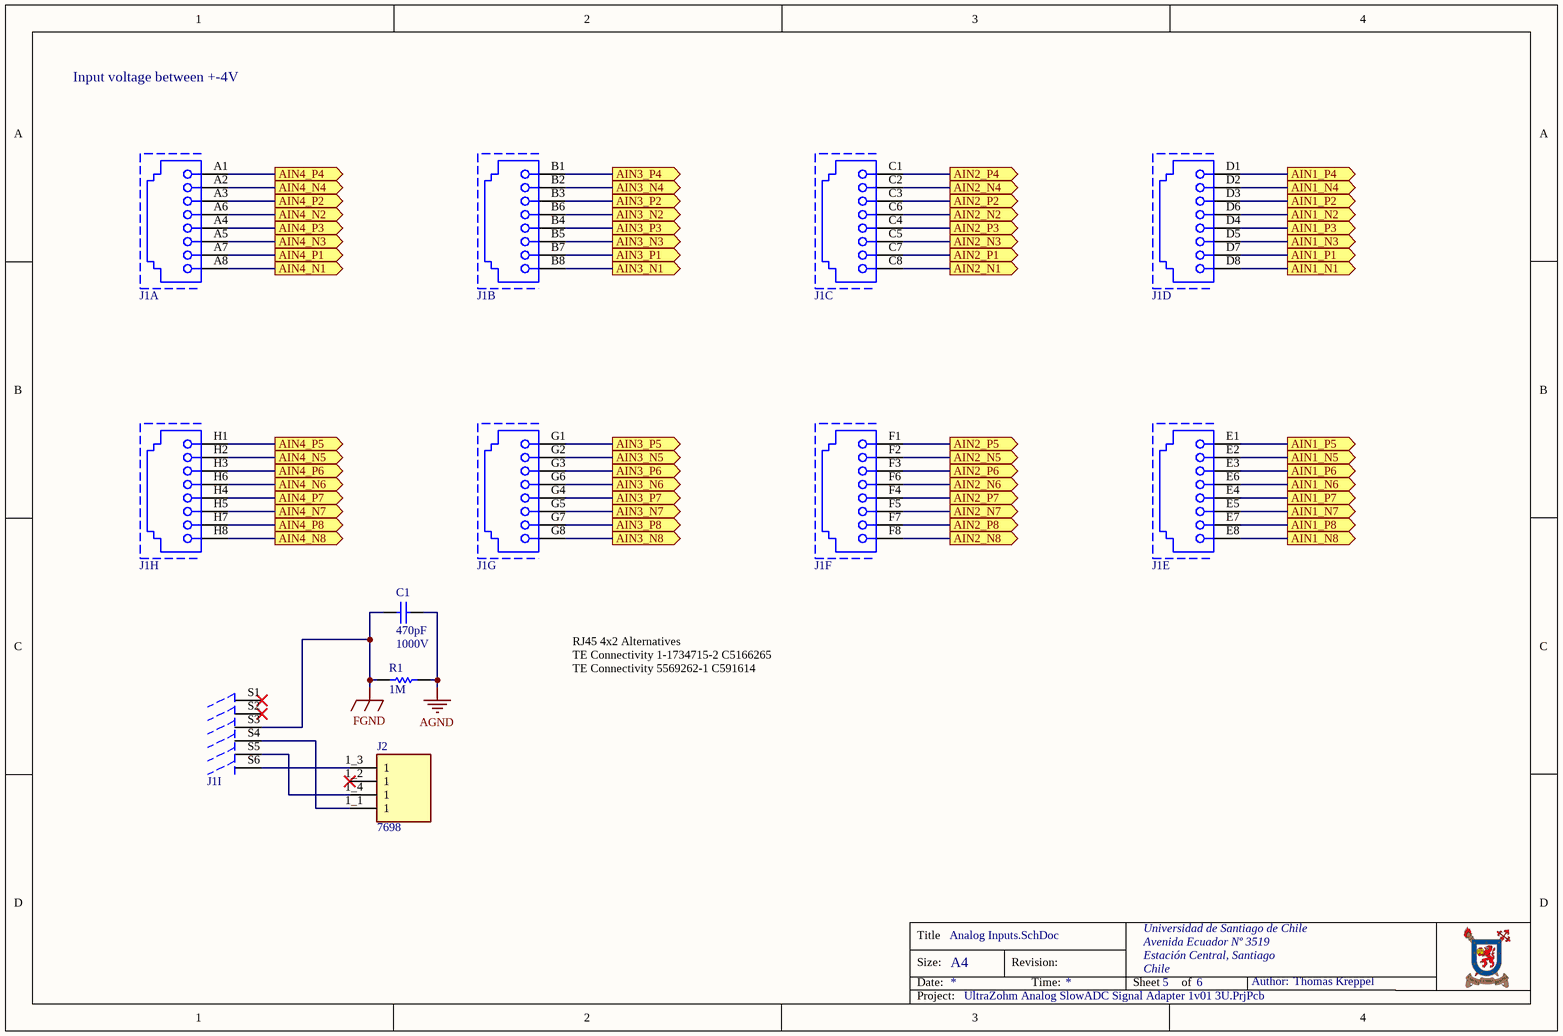
[diagram p2: Analog Inputs.SchDoc]

### Parts
C1  470pF  Voltage: 1000V  [RES_1206]
J1  Conector RJ-45 4x2  [RJ45 - 4x2]  (value not drawn)  (parts A,B,C,D,E,F,G,H,I of 9)
J2  7698  [KEYSTONE_7698]
R1  1M  [RES_1206]

### Ports
AIN1_N1 (out), AIN1_N2 (out), AIN1_N3 (out), AIN1_N4 (out), AIN1_N5 (out), AIN1_N6 (out), AIN1_N7 (out), AIN1_N8 (out), AIN1_P1 (out), AIN1_P2 (out), AIN1_P3 (out), AIN1_P4 (out), AIN1_P5 (out), AIN1_P6 (out), AIN1_P7 (out), AIN1_P8 (out), AIN2_N1 (out), AIN2_N2 (out), AIN2_N3 (out), AIN2_N4 (out), AIN2_N5 (out), AIN2_N6 (out), AIN2_N7 (out), AIN2_N8 (out), AIN2_P1 (out), AIN2_P2 (out), AIN2_P3 (out), AIN2_P4 (out), AIN2_P5 (out), AIN2_P6 (out), AIN2_P7 (out), AIN2_P8 (out), AIN3_N1 (out), AIN3_N2 (out), AIN3_N3 (out), AIN3_N4 (out), AIN3_N5 (out), AIN3_N6 (out), AIN3_N7 (out), AIN3_N8 (out), AIN3_P1 (out), AIN3_P2 (out), AIN3_P3 (out), AIN3_P4 (out), AIN3_P5 (out), AIN3_P6 (out), AIN3_P7 (out), AIN3_P8 (out), AIN4_N1 (out), AIN4_N2 (out), AIN4_N3 (out), AIN4_N4 (out), AIN4_N5 (out), AIN4_N6 (out), AIN4_N7 (out), AIN4_N8 (out), AIN4_P1 (out), AIN4_P2 (out), AIN4_P3 (out), AIN4_P4 (out), AIN4_P5 (out), AIN4_P6 (out), AIN4_P7 (out), AIN4_P8 (out)

### Nets
AGND: C1.2 R1.2
FGND: C1.1 J1.S3 R1.1
AIN1_N: J1.A8 ; port AIN4_N1
AIN1_N: J1.B8 ; port AIN3_N1  [a separate net that carries the same name]
AIN1_N: J1.C8 ; port AIN2_N1  [a separate net that carries the same name]
AIN1_N: J1.D8 ; port AIN1_N1  [a separate net that carries the same name]
AIN1_N: J1.E2 ; port AIN1_N5  [a separate net that carries the same name]
AIN1_N: J1.F2 ; port AIN2_N5  [a separate net that carries the same name]
AIN1_N: J1.G2 ; port AIN3_N5  [a separate net that carries the same name]
AIN1_N: J1.H2 ; port AIN4_N5  [a separate net that carries the same name]
AIN1_P: J1.A7 ; port AIN4_P1
AIN1_P: J1.B7 ; port AIN3_P1  [a separate net that carries the same name]
AIN1_P: J1.C7 ; port AIN2_P1  [a separate net that carries the same name]
AIN1_P: J1.D7 ; port AIN1_P1  [a separate net that carries the same name]
AIN1_P: J1.E1 ; port AIN1_P5  [a separate net that carries the same name]
AIN1_P: J1.F1 ; port AIN2_P5  [a separate net that carries the same name]
AIN1_P: J1.G1 ; port AIN3_P5  [a separate net that carries the same name]
AIN1_P: J1.H1 ; port AIN4_P5  [a separate net that carries the same name]
AIN2_N: J1.A6 ; port AIN4_N2
AIN2_N: J1.B6 ; port AIN3_N2  [a separate net that carries the same name]
AIN2_N: J1.C6 ; port AIN2_N2  [a separate net that carries the same name]
AIN2_N: J1.D6 ; port AIN1_N2  [a separate net that carries the same name]
AIN2_N: J1.E6 ; port AIN1_N6  [a separate net that carries the same name]
AIN2_N: J1.F6 ; port AIN2_N6  [a separate net that carries the same name]
AIN2_N: J1.G6 ; port AIN3_N6  [a separate net that carries the same name]
AIN2_N: J1.H6 ; port AIN4_N6  [a separate net that carries the same name]
AIN2_P: J1.A3 ; port AIN4_P2
AIN2_P: J1.B3 ; port AIN3_P2  [a separate net that carries the same name]
AIN2_P: J1.C3 ; port AIN2_P2  [a separate net that carries the same name]
AIN2_P: J1.D3 ; port AIN1_P2  [a separate net that carries the same name]
AIN2_P: J1.E3 ; port AIN1_P6  [a separate net that carries the same name]
AIN2_P: J1.F3 ; port AIN2_P6  [a separate net that carries the same name]
AIN2_P: J1.G3 ; port AIN3_P6  [a separate net that carries the same name]
AIN2_P: J1.H3 ; port AIN4_P6  [a separate net that carries the same name]
AIN3_N: J1.A5 ; port AIN4_N3
AIN3_N: J1.B5 ; port AIN3_N3  [a separate net that carries the same name]
AIN3_N: J1.C5 ; port AIN2_N3  [a separate net that carries the same name]
AIN3_N: J1.D5 ; port AIN1_N3  [a separate net that carries the same name]
AIN3_N: J1.E5 ; port AIN1_N7  [a separate net that carries the same name]
AIN3_N: J1.F5 ; port AIN2_N7  [a separate net that carries the same name]
AIN3_N: J1.G5 ; port AIN3_N7  [a separate net that carries the same name]
AIN3_N: J1.H5 ; port AIN4_N7  [a separate net that carries the same name]
AIN3_P: J1.A4 ; port AIN4_P3
AIN3_P: J1.B4 ; port AIN3_P3  [a separate net that carries the same name]
AIN3_P: J1.C4 ; port AIN2_P3  [a separate net that carries the same name]
AIN3_P: J1.D4 ; port AIN1_P3  [a separate net that carries the same name]
AIN3_P: J1.E4 ; port AIN1_P7  [a separate net that carries the same name]
AIN3_P: J1.F4 ; port AIN2_P7  [a separate net that carries the same name]
AIN3_P: J1.G4 ; port AIN3_P7  [a separate net that carries the same name]
AIN3_P: J1.H4 ; port AIN4_P7  [a separate net that carries the same name]
AIN4_N: J1.A2 ; port AIN4_N4
AIN4_N: J1.B2 ; port AIN3_N4  [a separate net that carries the same name]
AIN4_N: J1.C2 ; port AIN2_N4  [a separate net that carries the same name]
AIN4_N: J1.D2 ; port AIN1_N4  [a separate net that carries the same name]
AIN4_N: J1.E8 ; port AIN1_N8  [a separate net that carries the same name]
AIN4_N: J1.F8 ; port AIN2_N8  [a separate net that carries the same name]
AIN4_N: J1.G8 ; port AIN3_N8  [a separate net that carries the same name]
AIN4_N: J1.H8 ; port AIN4_N8  [a separate net that carries the same name]
AIN4_P: J1.A1 ; port AIN4_P4
AIN4_P: J1.B1 ; port AIN3_P4  [a separate net that carries the same name]
AIN4_P: J1.C1 ; port AIN2_P4  [a separate net that carries the same name]
AIN4_P: J1.D1 ; port AIN1_P4  [a separate net that carries the same name]
AIN4_P: J1.E7 ; port AIN1_P8  [a separate net that carries the same name]
AIN4_P: J1.F7 ; port AIN2_P8  [a separate net that carries the same name]
AIN4_P: J1.G7 ; port AIN3_P8  [a separate net that carries the same name]
AIN4_P: J1.H7 ; port AIN4_P8  [a separate net that carries the same name]
NetJ1_S4: J1.S4 J2.1_1(1)
NetJ1_S5: J1.S5 J2.1_4(1)
NetJ1_S6: J1.S6 J2.1_3(1)

Not connected (* = marked no-connect by the designer): J1 S1* S2*; J2 1_2(1)*

### Notes on the sheet
- Input voltage between +-4V
- RJ45 4x2 Alternatives
  TE Connectivity 1-1734715-2 C5166265
  TE Connectivity 5569262-1 C591614
- Title
- Size:
- Date:
- A4
- Revision:
- Time:
- Sheet
- of
- Author:
- Project:

### Library data of the parts
C1 = Cap_1206: Capacitor; MPN: 885342208017; MF: Würth Elektronik; Dielectricum: X7R; Tolerance: 10%; Supplier Part Number 1: 732-12097-1-ND; Value: 470pF; Supplier 1: Digikey; Package: 1206
J1 = Conector RJ-45 4x2: MPN: 5569262-1; MF: TE Connectivity; Supplier Part Number 1: A118195-ND; Supplier 1: Digikey; LCSC Part Number: C591614
J2 = 7698: Screw Terminal;Nickel;15 Amp;Snap-In;Vertical;Unassembled;M3 Thrd | Keystone Electronics 7698; SnapEDA_Link: https://www.snapeda.com/parts/7698/Keystone/view-part/?ref=snap; Package: None; Value: *; MF: Keystone; MP: 7698; Check_prices: https://www.snapeda.com/parts/7698/Keystone/view-part/?ref=eda; LCSC Part Number: C6708741
R1 = Res1206: Resistor; MPN: RC1206FR-071ML; MF: Yageo; Tolerance: 1%; Supplier Part Number 1: 311-1.00MFRCT-ND; Value: 1M; Supplier 1: Digikey; Package: 1206

## Sheet Power supplies.SchDoc
size A4; Author: Thomas Kreppel; CompanyName: Universidad de Santiago de Chile; Address1: Avenida Ecuador Nº 3519; Address2: Estación Central, Santiago; Address3: Chile; DocumentNumber: 6; Revision: 1v01; SheetNumber: 6; SheetTotal: 6
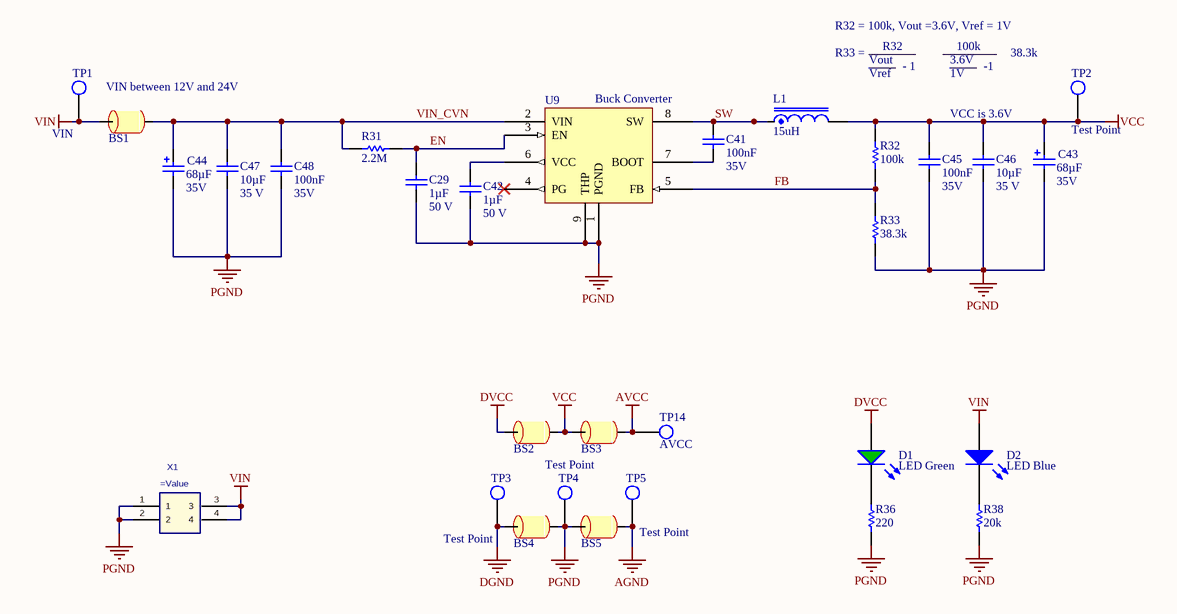
[diagram p3: Power supplies.SchDoc]

### Parts
BS1  Ferrite bead  [RES_1206]  (value not drawn)
BS2  Ferrite bead  [RES_1206]  (value not drawn)
BS3  Ferrite bead  [RES_1206]  (value not drawn)
BS4  Ferrite bead  [RES_1206]  (value not drawn)
BS5  Ferrite bead  [RES_1206]  (value not drawn)
C29  1µF  Voltage: 50 V  [CAP_0603]
C41  100nF  Voltage: 35V  [CAP_0603]
C42  1µF  Voltage: 50 V  [CAP_0603]
C43  68µF  Voltage: 35V  [WCAP-ATG8_6.3x11]
C44  68µF  Voltage: 35V  [WCAP-ATG8_6.3x11]
C45  100nF  Voltage: 35V  [CAP_0603]
C46  10µF  Voltage: 35 V  [RES_1206]
C47  10µF  Voltage: 35 V  [RES_1206]
C48  100nF  Voltage: 35V  [CAP_0603]
D1  LED Green  [WL-SMCW_0603]
D2  LED Blue  [WL-SMCW_0603]
L1  15uH  [SMT_inductor_1050_Performance]
R31  2.2M  [RES_0603]
R32  100k  [RES_0603]
R33  38.3k  [RES_0603]
R36  220  [RES_0603]
R38  20k  [RES_0603]
TP1  VIN  [TP_1.6mm]  (no BOM)
TP2  Test Point  [TP_1.6mm]  (no BOM)
TP3  Test Point  [TP_1.6mm]  (no BOM)
TP4  Test Point  [TP_1.6mm]  (no BOM)
TP5  Test Point  [TP_1.6mm]  (no BOM)
TP14  AVCC  [TP_1.6mm]  (no BOM)
U9  Buck Converter  [SOIC127P600X170_HS-9N]
X1  (no value)  [IPL1-102-01-L-D-K]

### Nets
AGND: BS5.2 TP5.1
AVCC: BS3.2 TP14.1
DGND: BS4.1 TP3.1
DVCC: BS2.1 D1.2(A)
PGND: BS4.2 BS5.1 C29.2 C42.2 C43.1(N) C44.1(N) C45.2 C46.2 C47.2 C48.2 R33.1 R36.1 R38.2 TP4.1 U9.1(PGND) U9.9(THP) X1.1 X1.2
VCC: BS2.2 BS3.1 C43.2(P) C45.1 C46.1 L1.2 R32.2 TP2.1
VIN: BS1.1 D2.2(A) TP1.1 X1.3 X1.4
EN: C29.1 R31.1 U9.3(EN)
FB: R32.1 R33.2 U9.5(FB)
SW: C41.1 L1.1 U9.8(SW)
VIN_CVN: BS1.2 C44.2(P) C47.1 C48.1 R31.2 U9.2(VIN)
NetC41_2: C41.2 U9.7(BOOT)
NetC42_1: C42.1 U9.6(VCC)
NetD1_1: D1.1(K) R36.2
NetD2_1: D2.1(K) R38.1

Not connected (* = marked no-connect by the designer): U9 4(PG)*

### Notes on the sheet
- R32 = 100k, Vout =3.6V, Vref = 1V
- R33 =
- Vout
- R32
- 3.6V
- 100k
- (near TP2) 38.3k
- VIN between 12V and 24V
- Vref
- - 1
- VCC is 3.6V
- 1V
- -1
- Title
- Size:
- Date:
- A4
- Revision:
- Time:
- Sheet
- of
- Author:
- Project:

### Library data of the parts
BS1-BS5 = Bead: 6A; MPN: 742792121; MF: Würth Elektronik; DCR: 60mOhm; I_r: 3A; Supplier 1: Digikey; Supplier Part Number 1: 732-4654-1-ND; Package: 1206; LCSC Part Number: C5271178
C29 = Cap_0603: Capacitor Ceramic; MPN: C0603C105K3RACTU; MF: KEMET; Tolerance: 10%; Dielectricum: X7R; Value: 1µF; Supplier 1: Digikey; Supplier Part Number 1: 399-7376-1-ND; Package: 0603; LCSC Part Number: C2177372
C41 C45 C48 = Cap_0603: as C35 on sheet Interface Connector; Published: 8-Jun-2000; LatestRevisionDate: 17-Jul-2002; LatestRevisionNote: Re-released for DXP Platform.; PackageReference: RAD-0.3; Publisher: Altium Limited; Value: 100nF; Supplier 1: Digikey; Supplier Part Number 1: 399-7845-1-ND; Package: 0603; LCSC Part Number: C14663
  C41: Supplier 2: Mouser
C42 = Cap_0603: Capacitor Ceramic; MPN: C0603C105K3RACTU; MF: KEMET; Dielectricum: X7R; Tolerance: 10%; Value: 1µF; Supplier 1: Digikey; Supplier Part Number 1: 399-7376-1-ND; Package: 0603; LCSC Part Number: C2177372
C43 C44 = 860010573006: WCAP-ATG8 THT Aluminum Electrolytic Capacitors, D6.3mm x L11mm, 68uF, +/-20%, 35VDC; Dissipation Factor: 12%; Endurance: 2000h; Leakage Current: 23.8uA; Ripple Current max.: 198mA; Technical Reference: ATBD110680M035DSPA4B000; ComponentLink1Description: Manufacturer; ComponentLink1URL: http://www.we-online.de; ComponentLink2Description: Datasheet; ComponentLink2URL: https://katalog.we-online.com/pbs/datasheet/860010573006.pdf; Length: 11mm; Mounting Technology: THT; Operating Temperature: -40 to +85degC; Packaging: Ammo Pack; Published Date: August 2019; Value: 68µF; Diameter: 6.3mm; Part Number: 860010573006; Publisher: Wurth Elektronik; Tolerance: +/-20%; Supplier 1: Digikey; Supplier Part Number 1: 732-8736-1-ND; LCSC Part Number: C1668506
C46 C47 = Cap_1206: Capacitor; MPN: GRM319R6YA106KA12D; Dielectricum: X7R; Tolerance: 10%; Value: 10µF; Supplier 1: Digikey; Supplier Part Number 1: 490-9964-1-ND; MF: *; Package: 1206; LCSC Part Number: C123678
D1 = UZgen_LED_0603_Green: Standard LEDs - SMD 0603 green; Manufacturer: UZgen; Created from: UZgenTool; ComponentLink1Description: N/A; ComponentLink1URL: N/A; Supplier 1: LCSC; Supplier Part Number 1: C2986059; Manufacturer Part Number: UZgen_LED_0603_Green; PartID: 21; Created On: 09/09/2024 10:45:01; Component Type: LED Diode; Device Package: 0603; Last Updated: 09/09/2024 10:45:01; Mounting Type: SMD; Type: Standard; Value: LED Green; Live Cycle Status: 1; Stock number: not stored; Color: green; LCSC Part Number: C2986059
D2 = UZgen_LED_0603_Blue: Standard LEDs - SMD 0603 blue; Manufacturer: UZgen; Created from: UZgenTool; ComponentLink1Description: N/A; ComponentLink1URL: N/A; Supplier 1: LCSC; Supplier Part Number 1: C965807; Manufacturer Part Number: UZgen_LED_0603_Blue; PartID: 20; Created On: 09/09/2024 10:45:01; Component Type: LED Diode; Device Package: 0603; Last Updated: 09/09/2024 10:45:01; Mounting Type: SMD; Type: Standard; Value: LED Blue; Live Cycle Status: 1; Stock number: not stored; Color: blue; LCSC Part Number: C965807
L1 = B82464G4154M: SMT power Inductor, 15uH, 40m DRC; Rated Current: 3.7 A; MF: Murata; Supplier 1: Digikey; Supplier Part Number 1: 811-3837-1-ND; Value: 15uH; DCR: 40m; Supplier 2: Mouser; LCSC Part Number: C6818993
R31 = Res0603: MPN: RC0603FR-072M2L; MF: Yageo; Tolerance: 1%; Published: 8-Jun-2000; LatestRevisionDate: 17-Jul-2002; LatestRevisionNote: Re-released for DXP Platform.; PackageReference: AXIAL-0.3; Publisher: Altium Limited; PackageDescription: Axial Device, Thru-Hole; 2 Leads; 0.3 in Pin Spacing; Value: 2.2M; Supplier 1: Digikey; Supplier Part Number 1: YAG3329CT-ND; Package: 0603
R32 = Res0603: MPN: RC0603FR-07100KL; MF: Yageo; Tolerance: 1%; Published: 8-Jun-2000; LatestRevisionDate: 17-Jul-2002; LatestRevisionNote: Re-released for DXP Platform.; PackageReference: AXIAL-0.3; Publisher: Altium Limited; PackageDescription: Axial Device, Thru-Hole; 2 Leads; 0.3 in Pin Spacing; Value: 100k; Supplier 1: Digikey; Supplier Part Number 1: 311-100KHRCT-ND; Package: 0603
R33 = Res0603: Tolerance: 1%; Published: 8-Jun-2000; LatestRevisionDate: 17-Jul-2002; LatestRevisionNote: Re-released for DXP Platform.; PackageReference: AXIAL-0.3; Publisher: Altium Limited; PackageDescription: Axial Device, Thru-Hole; 2 Leads; 0.3 in Pin Spacing; Value: 38.3k; Supplier 1: Digikey; Supplier 2: Mouser; Supplier Part Number 1: 311-38.3KHRCT-ND; Package: 0603
R36 = Res0603: MPN: RC0603JR-07220RL; Tolerance: 1%; Published: 8-Jun-2000; LatestRevisionDate: 17-Jul-2002; LatestRevisionNote: Re-released for DXP Platform.; PackageReference: AXIAL-0.3; Publisher: Altium Limited; PackageDescription: Axial Device, Thru-Hole; 2 Leads; 0.3 in Pin Spacing; Value: 220; Supplier 1: Digikey; Supplier 2: Mouser; Supplier Part Number 1: 311-220GRCT-ND; Package: 0603
R38 = Res0603: MPN: RC0603FR-07330RL; MF: Yageo; Tolerance: 1%; Published: 8-Jun-2000; LatestRevisionDate: 17-Jul-2002; LatestRevisionNote: Re-released for DXP Platform.; PackageReference: AXIAL-0.3; Publisher: Altium Limited; PackageDescription: Axial Device, Thru-Hole; 2 Leads; 0.3 in Pin Spacing; Supplier Part Number 1: 311-330HRCT-ND; Value: 20k; Supplier 1: Digikey; Package: 0603
TP1-TP5 TP14 = TP: as TP6 on sheet Interface Connector; Created: 2020_04_Kreppel; Supplier 1: Digikey; Supplier Part Number 1: 36-5006-ND
U9 = LMR33620A: 3.8V to 36V, 2A synchronous step-down converter; MPN: LMR33620ADDA; Switching frequency: 400kHz; MF: Texas Instruments; Created: 4/20 Kreppel; Supplier 1: Digikey; Supplier Part Number 1: 296-48841-ND; Supplier 2: Mouser; LCSC Part Number: C2071694
X1 = IPL1-102-XX-X-D-X: 2.54mm Double Row Terminal Assembly, Right-Angled; MF: SAMTEC; Value: IPL1-102-01-L-D-K; Created: 2018_05_02_AGeiger; MPN: IPL1-102-01-L-D-K; MF: Samtec; Supplier 1: Digikey; Supplier Part Number 1: SAM10565-ND